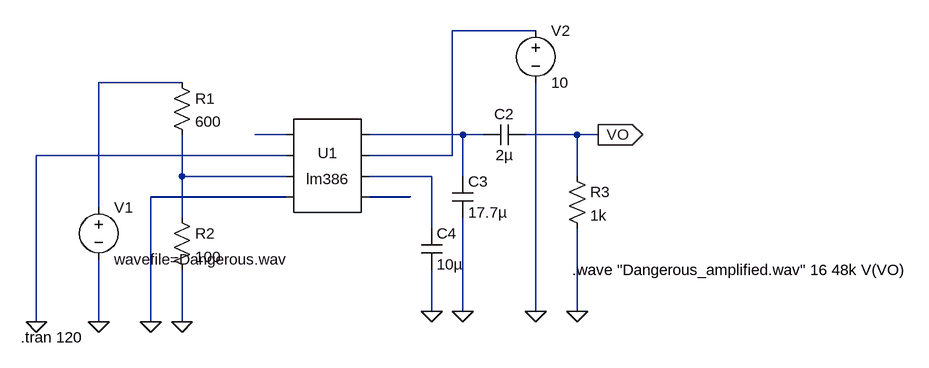
[diagram p0: schematic lm386_audioamp.asc]
lm386_audioamp.asc, the LTspice schematic file:
Version 4
SHEET 1 1152 680
WIRE 528 -64 400 -64
WIRE -16 16 -144 16
WIRE 144 96 96 96
WIRE 416 96 272 96
WIRE 448 96 416 96
WIRE 592 96 512 96
WIRE 624 96 592 96
WIRE 144 128 -240 128
WIRE 400 128 400 -64
WIRE 400 128 272 128
WIRE -16 160 -16 96
WIRE 144 160 -16 160
WIRE 368 160 272 160
WIRE 416 160 416 96
WIRE 592 160 592 96
WIRE 144 192 -64 192
WIRE 336 192 272 192
WIRE -144 208 -144 16
WIRE -16 224 -16 160
WIRE 368 240 368 160
WIRE 368 368 368 304
WIRE 416 368 416 224
WIRE 528 368 528 16
WIRE 592 368 592 240
WIRE -240 384 -240 128
WIRE -144 384 -144 288
WIRE -64 384 -64 192
WIRE -16 384 -16 304
FLAG -144 384 0
FLAG 528 368 0
FLAG -240 384 0
FLAG -64 384 0
FLAG 624 96 VO
IOPIN 624 96 Out
FLAG 416 368 0
FLAG 368 368 0
FLAG 592 368 0
FLAG -16 384 0
SYMBOL AutoGenerated\\lm386 208 144 R0
SYMATTR InstName U1
SYMBOL voltage -144 192 R0
SYMATTR InstName V1
SYMATTR Value wavefile=Dangerous.wav
SYMBOL voltage 528 -80 R0
WINDOW 123 0 0 Left 0
WINDOW 39 0 0 Left 0
SYMATTR InstName V2
SYMATTR Value 10
SYMBOL cap 512 80 R90
WINDOW 0 0 32 VBottom 2
WINDOW 3 32 32 VTop 2
SYMATTR InstName C2
SYMATTR Value 2µ
SYMBOL cap 400 160 R0
SYMATTR InstName C3
SYMATTR Value 17.7µ
SYMBOL cap 352 240 R0
SYMATTR InstName C4
SYMATTR Value 10µ
SYMBOL res 576 144 R0
SYMATTR InstName R3
SYMATTR Value 1k
SYMBOL res -32 0 R0
SYMATTR InstName R1
SYMATTR Value 600
SYMBOL res -32 208 R0
SYMATTR InstName R2
SYMATTR Value 100
TEXT 584 304 Left 2 !.wave "Dangerous_amplified.wav" 16 48k V(VO)
TEXT -264 408 Left 2 !.tran 120

The netlist it stands for:
* lm386_audioamp.asc
* U1: lm386 (symbol AutoGenerated\lm386 not available, pins judged from their places): pin1=N003 pin2=0 pin3=N005 pin4=0 pin5=N004 pin6=N001 pin7=N006 pin8=N007
V1 N002 0 wavefile=Dangerous.wav
V2 N001 0 10
C2 VO N004 2µ
C3 N004 0 17.7µ
C4 N006 0 10µ
R3 VO 0 1k
R1 N002 N005 600
R2 N005 0 100
.wave "Dangerous_amplified.wav" 16 48k V(VO)
.tran 120
.backanno
.end